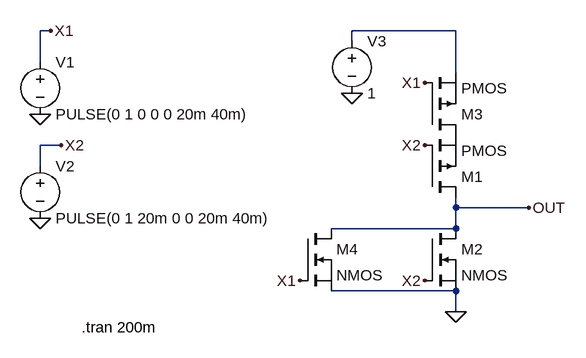
[diagram p0: schematic Draft1.asc]
Draft1.asc, the LTspice schematic file:
Version 4.1
SHEET 1 880 680
WIRE -384 -96 -400 -96
WIRE 240 -96 80 -96
WIRE 80 -80 80 -96
WIRE -400 -48 -400 -96
WIRE 240 -32 240 -96
WIRE -368 80 -400 80
WIRE -400 112 -400 80
WIRE 240 176 240 160
WIRE 352 176 240 176
WIRE 240 208 240 176
WIRE 240 208 48 208
WIRE 240 304 48 304
WIRE 240 336 240 304
FLAG 240 336 0
FLAG 352 176 OUT
FLAG -400 192 0
FLAG -400 32 0
FLAG -384 -96 X1
FLAG 192 -16 X1
FLAG 0 288 X1
FLAG -368 80 X2
FLAG 192 80 X2
FLAG 192 288 X2
FLAG 80 0 0
SYMBOL pmos 192 160 M180
SYMATTR InstName M1
SYMBOL nmos 192 208 R0
SYMATTR InstName M2
SYMBOL pmos 192 64 M180
SYMATTR InstName M3
SYMBOL nmos 0 208 R0
SYMATTR InstName M4
SYMBOL voltage -400 -64 R0
SYMATTR InstName V1
SYMATTR Value PULSE(0 1 0 0 0 20m 40m)
SYMBOL voltage -400 96 R0
WINDOW 123 0 0 Left 0
WINDOW 39 0 0 Left 0
SYMATTR InstName V2
SYMATTR Value PULSE(0 1 20m 0 0 20m 40m)
SYMBOL voltage 80 -96 R0
SYMATTR InstName V3
SYMATTR Value 1
TEXT -336 360 Left 2 !.tran 200m

The netlist it stands for:
* Draft1.asc
M1 OUT X2 P001 P001 PMOS
M2 OUT X2 0 0 NMOS
M3 P001 X1 N001 N001 PMOS
M4 OUT X1 0 0 NMOS
V1 X1 0 PULSE(0 1 0 0 0 20m 40m)
V2 X2 0 PULSE(0 1 20m 0 0 20m 40m)
V3 N001 0 1
.model NMOS NMOS
.model PMOS PMOS
.lib standard.mos
.tran 200m
.backanno
.end